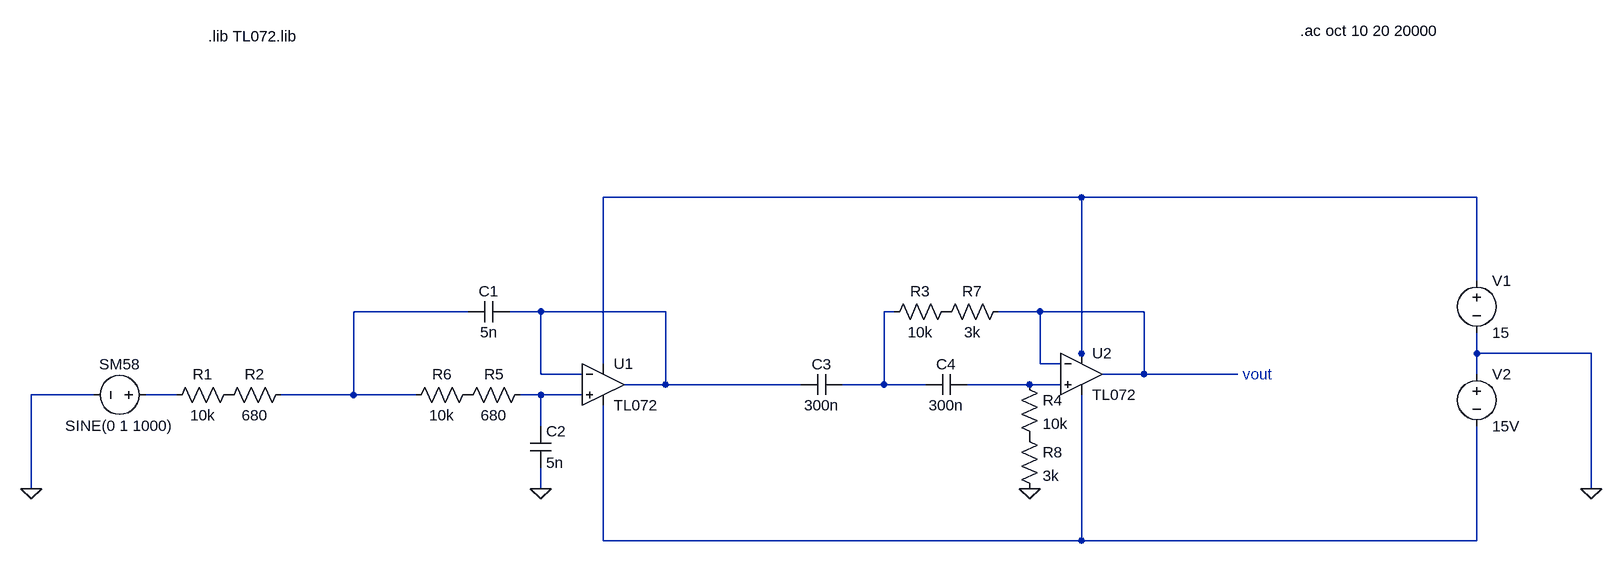
[diagram p0: schematic Bandpass Circuit.asc]
Bandpass Circuit.asc, the LTspice schematic file:
Version 4
SHEET 1 1824 680
WIRE 1024 112 288 112
WIRE 1632 112 1024 112
WIRE 1632 240 1632 112
WIRE 80 288 -96 288
WIRE 192 288 144 288
WIRE 384 288 192 288
WIRE 736 288 720 288
WIRE 960 288 896 288
WIRE 1120 288 960 288
WIRE 1024 352 1024 112
WIRE 1632 352 1632 320
WIRE 1808 352 1632 352
WIRE 288 368 288 112
WIRE 960 368 960 288
WIRE 992 368 960 368
WIRE 1024 368 1024 352
WIRE 192 384 192 288
WIRE 256 384 192 384
WIRE 1120 384 1120 288
WIRE 1120 384 1056 384
WIRE 1264 384 1120 384
WIRE 1632 384 1632 352
WIRE 384 400 384 288
WIRE 384 400 320 400
WIRE 592 400 384 400
WIRE 720 400 720 288
WIRE 720 400 656 400
WIRE 784 400 720 400
WIRE 944 400 848 400
WIRE 992 400 944 400
WIRE -496 416 -592 416
WIRE -368 416 -416 416
WIRE -96 416 -96 288
WIRE -96 416 -208 416
WIRE 0 416 -96 416
WIRE 192 416 160 416
WIRE 256 416 192 416
WIRE 192 464 192 416
WIRE -592 560 -592 416
WIRE 192 560 192 528
WIRE 1808 560 1808 352
WIRE 288 640 288 432
WIRE 1024 640 1024 416
WIRE 1024 640 288 640
WIRE 1632 640 1632 464
WIRE 1632 640 1024 640
FLAG 192 560 0
FLAG 1808 560 0
FLAG -592 560 0
FLAG 944 560 0
SYMBOL Voltage 1632 224 R0
SYMATTR InstName V1
SYMATTR Value 15
SYMBOL Voltage 1632 368 R0
SYMATTR InstName V2
SYMATTR Value 15V
SYMBOL Cap 144 272 R90
WINDOW 0 0 32 VBottom 2
WINDOW 3 32 32 VTop 2
SYMATTR InstName C1
SYMATTR Value 5n
SYMBOL Cap 176 464 R0
SYMATTR InstName C2
SYMATTR Value 5n
SYMBOL OpAmps/opamp2 288 336 R0
SYMATTR InstName U1
SYMATTR Value TL072
SYMBOL Cap 656 384 R90
WINDOW 0 0 32 VBottom 2
WINDOW 3 32 32 VTop 2
SYMATTR InstName C3
SYMATTR Value 300n
SYMBOL Cap 848 384 R90
WINDOW 0 0 32 VBottom 2
WINDOW 3 32 32 VTop 2
SYMATTR InstName C4
SYMATTR Value 300n
SYMBOL OpAmps/opamp2 1024 320 R0
SYMATTR InstName U2
SYMATTR Value TL072
SYMBOL Voltage -400 416 R90
WINDOW 0 -32 56 VBottom 2
WINDOW 3 32 56 VTop 2
SYMATTR InstName SM58
SYMATTR Value SINE(0 1 1000)
SYMATTR Value2 AC 1
SYMATTR SpiceLine Rser=150
SYMBOL Res -272 400 R90
WINDOW 0 0 56 VBottom 2
WINDOW 3 32 56 VTop 2
SYMATTR InstName R1
SYMATTR Value 10k
SYMBOL Res -192 400 R90
WINDOW 0 0 56 VBottom 2
WINDOW 3 32 56 VTop 2
SYMATTR InstName R2
SYMATTR Value 680
SYMBOL Res 176 400 R90
WINDOW 0 0 56 VBottom 2
WINDOW 3 32 56 VTop 2
SYMATTR InstName R5
SYMATTR Value 680
SYMBOL Res 96 400 R90
WINDOW 0 0 56 VBottom 2
WINDOW 3 32 56 VTop 2
SYMATTR InstName R6
SYMATTR Value 10k
SYMBOL Res 832 272 R90
WINDOW 0 0 56 VBottom 2
WINDOW 3 32 56 VTop 2
SYMATTR InstName R3
SYMATTR Value 10k
SYMBOL Res 912 272 R90
WINDOW 0 0 56 VBottom 2
WINDOW 3 32 56 VTop 2
SYMATTR InstName R7
SYMATTR Value 3k
SYMBOL Res 928 384 R0
SYMATTR InstName R4
SYMATTR Value 10k
SYMBOL Res 928 464 R0
SYMATTR InstName R8
SYMATTR Value 3k
TEXT -320 -136 Left 2 !.lib TL072.lib
TEXT 1272 384 Left 2 ;vout
TEXT 1360 -144 Left 2 !.ac oct 10 20 20000

The netlist it stands for:
* Bandpass Circuit.asc
V1 N001 0 15
V2 0 N009 15V
C1 N003 N002 5n
C2 N008 0 5n
XU1 N008 N003 N001 N009 N003 TL072  ; pins In+ In- V+ V- OUT
C3 N004 N003 300n
C4 N006 N004 300n
XU2 N006 N005 N001 N009 N005 TL072  ; pins In+ In- V+ V- OUT
V§SM58 N007 0 SINE(0 1 1000) AC 1 Rser=150
R1 P001 N007 10k
R2 N002 P001 680
R5 N008 P002 680
R6 P002 N002 10k
R3 P003 N004 10k
R7 N005 P003 3k
R4 N006 P004 10k
R8 P004 0 3k
.lib TL072.lib
* vout
.ac oct 10 20 20000
.backanno
.end